# Altium project FMC_Delay_1ns_4Cha.PrjPcb (part 3 of 3)

## Sheet LED_MEM.SchDoc: LEDs, sensors and ID EEPROM
size 297 x 209 mm; CheckedBy: -; CompanyName: CERN; DrawnBy: GK, TW; Organization: CERN; Address1: European Organization for Nuclear Research; Address2: CH-1211 Geneve 23 - Switzerland; Revision: -; SheetNumber: 4; SheetTotal: 9; EDA_Number: EDA-02667-V2-0; Projet: FMC Delay 1ns 4cha; ModifiedBy: -; CreateDate: XX/XX/XXXX; CheckedDate: -; DivGrp: BE-CO; Designer: GK, TW; ModifiedDate: -
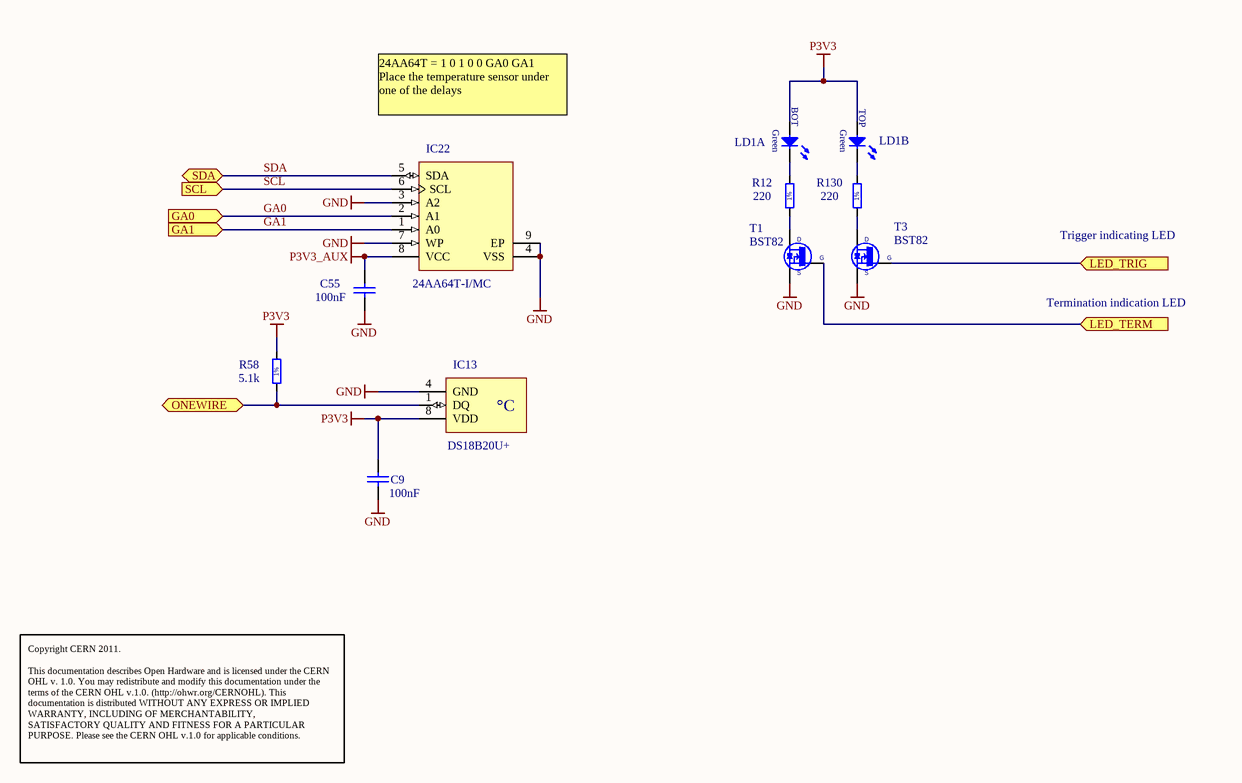
[diagram p8: LED_MEM.SchDoc]

### Parts
C9  100nF  [CAPC1608X87N]
C55  100nF  [CAPC1608X87N]
IC13  DS18B20U+  [SOP65P490X110-8N]
IC22  24AA64T-I/MC  [SON50P300X200X100-9N-S175X155]
LD1  Green/Green  [LED_DIALIGHT_571-0122-100F]  (value not drawn)  (parts A,B of 2)
R12  220  [RESC1608X55N]
R58  5.1k  [RESC1608X55N]
R130  220  [RESC1608X55N]
T1  BST82  [SOT95P240X110-3N]
T3  BST82  [SOT95P240X110-3N]

### Ports
GA0 (in), GA1 (in), LED_TERM (in), LED_TRIG (in), ONEWIRE (bidir), SCL (in), SDA (bidir)

### Nets
GND: C9.2 C55.2 IC13.4(GND) IC22.3(A2) IC22.4(VSS) IC22.7(WP) IC22.9(EP) T1.2(S) T3.2(S)
P3V3: C9.1 IC13.8(VDD) LD1.2(A) LD1.4(A) R58.2
P3V3_AUX: C55.1 IC22.8(VCC)
GA0: IC22.2(A1) ; port GA0
GA1: IC22.1(A0) ; port GA1
LED_TERM: T1.1(G) ; port LED_TERM
SCL: IC22.6(SCL) ; port SCL
SDA: IC22.5(SDA) ; port SDA
NetIC13_1: IC13.1(DQ) R58.1 ; port ONEWIRE
NetLD1_1: LD1.1(C) R12.2
NetLD1_3: LD1.3(C) R130.2
NetR12_1: R12.1 T1.3(D)
NetR130_1: R130.1 T3.3(D)
NetT3_1: T3.1(G) ; port LED_TRIG

### Notes on the sheet
- 24AA64T = 1 0 1 0 0 GA0 GA1
  Place the temperature sensor under one of the delays
- Trigger indicating LED
- Termination indication LED
- Copyright CERN 2011.
  This documentation describes Open Hardware and is licensed under the CERN OHL v. 1.0. You may redistribute and modify this documentation under the terms of the CERN OHL v.1.0. (http://ohwr.org/CERNOHL). This documentation is distributed WITHOUT ANY EXPRESS OR IMPLIED WARRANTY, INCLUDING OF MERCHANTABILITY, SATISFACTORY QUALITY AND FITNESS FOR A PARTICULAR PURPOSE. Please see the CERN OHL v.1.0 for applicable conditions.
- Project/Equipment
- Document
- Designer
- Drawn by
- Check.by
- File
- Last Mod.
- Print Date
- Sheet
- Size
- A4
- of
- Rev
- (in symbol DS18B20U+) °C
- (in symbol LED_DIALIGHT_571-0122-100F, part A) BOT; Green
- (in symbol LED_DIALIGHT_571-0122-100F, part B) TOP; Green
- (in symbol R0603_5K1_1%_0.1W_100PPM) 1%
- (in symbol R0603_220R_1%_0.1W_100PPM) 1%

### Library data of the parts
C9 C55 = CC0603_100NF_50V_10%_X7R: as C75-C77 on sheet INPUT_LOGIC; Part Number: CC0603_100NF_50V_10%_X7R; Component Kind: Standard; Component Type: Standard; Pin Count: 2; Value: 100nF; Status: Preferred; Manufacturer Part Number: CC0603_100NF_50V_10%_X7R; Case: 0603; Mounted: Yes; Socket: No; SMD: Yes; Manufacturer1 Example: PHYCOMP; Manufacturer1 ComponentHeight: 0.87mm; HelpURL: \\cern.ch\dfs\Applications\Altium\Datasheets\CC0603_X7R_PHYCOMP.pdf; Author: CERN DEM JLC; CreateDate: 12/3/2007; LatestRevisionDate: 12/3/2007
IC13 = DS18B20U+: Programmable Resolution 1-Wire Digital Thermometer; Part Description: Programmable Resolution 1-Wire Digital Thermometer (-55°C to +125°C); Manufacturer: DALLAS MAXIM; Table: Sensors; Part Number: DS18B20U+; Component Kind: Standard; Component Type: Standard; Device: DS18B20U+; PackageDescription: SOP, 0.65mm pitch; 8 pin, 3.00mm W X 3.00mm L X 1.10mm H body, IPC Medium Density; Manufacturer Part Number: DS18B20U+; Pin Count: 3; Case: uSOP8; Mounted: Yes; Socket: No; SMD: No; ComponentHeight: 1.1mm; HelpURL: \\cern.ch\dfs\Applications\Altium\Datasheets\DS18B20U+.pdf; Author: CERN DEM JLC; CreateDate: 3/17/2010; LatestRevisionDate: 3/17/2010
IC22 = 24AA64T-I/MC: 1.7-5.5V 64K I2C Serial EEPROM; Part Description: 1.7V-5.5V, 64K  (8K x 8-bit) I2C Serial EEPROM; Manufacturer: MICROCHIP TECHNOLOGY; Table: Logic; Part Number: 24AA64T-I/MC; Component Kind: Standard; Component Type: Standard; Device: 24AA64T-I/MC; PackageDescription: SON (DFN), 0.50mm pitch, 8 pin, 2mm X 3mm X 1.00mm H body (w/thermal tab 1.75 X 1.55mm),  IPC Medium Density; Manufacturer Part Number: 24AA64T-I/MC; Pin Count: 9; Case: DFN8; Mounted: Yes; Socket: No; SMD: Yes; ComponentHeight: 1.0mm; HelpURL: \\cern.ch\dfs\Applications\Altium\Datasheets\24AA64T-I-MC.pdf; Author: CERN DEM JLC; CreateDate: 11/18/2009; LatestRevisionDate: 1/24/2011
LD1 = LED_DIALIGHT_571-0122-100F: LED x2 Green 1C2A-BOT_3C4A-TOP; Part Description: Dual 2mm Green LEDs CBI® Circuit Board Indicator (With positioning pins); Table: LEDs & Displays; Part Number: LED_DIALIGHT_571-0122-100F; Component Kind: Standard; Component Type: Standard; Color: Green/Green; PackageDescription: 2x 2mm Red LED PCB Edge Mounting (With positioning pins) DIALIGHT 571 Serie; Manufacturer: DIALIGHT; Manufacturer Part Number: 571-0122-100F; Pin Count: 4; Mounted: Yes; Socket: No; SMD: No; ComponentHeight: 8.6mm; HelpURL: \\cern.ch\dfs\Applications\Altium\Datasheets\LED_DIALIGHT_571-0122-100F.pdf; Author: CERN DEM JLC; CreateDate: 11/5/2009; LatestRevisionDate: 3/17/2010
R12 R130 = R0603_220R_1%_0.1W_100PPM: Resistor - 1%; Part Description: General Purpose Thick Film Chip Resistor; Manufacturer: GENERIC; Manufacturer1 Part Number: NRC06F2200TRF; Power: 0.1W; TC: ±100ppm/°C; Table: Resistors SMD; Part Number: R0603_220R_1%_0.1W_100PPM; Component Kind: Standard; Component Type: Standard; Pin Count: 2; Value: 220; Status: Preferred; Tolerance: ±1%; Manufacturer Part Number: R0603_220R_1%_0.1W_100PPM; Case: 0603; Mounted: Yes; Socket: No; SMD: Yes; Manufacturer1 Example: NIC COMPONENT; Manufacturer1 ComponentHeight: 0.55mm; HelpURL: \\cern.ch\dfs\Applications\Altium\Datasheets\R0603_NIC_NRC.pdf; Author: CERN DEM JLC; CreateDate: 12/3/2007; LatestRevisionDate: 3/13/2008
R58 = R0603_5K1_1%_0.1W_100PPM: Resistor - 1%; Part Description: General Purpose Thick Film Chip Resistor; Manufacturer: GENERIC; Manufacturer1 Part Number: NRC06F5101TRF; Value: 5k1; Power: 0.1W; TC: ±100ppm/°C; Table: Resistors SMD; Part Number: R0603_5K1_1%_0.1W_100PPM; Component Kind: Standard; Component Type: Standard; Designator: Resistor - 1%; Library Reference: Resistor - 1%; Pin Count: 2; Status: Preferred; Tolerance: ±1%; Manufacturer Part Number: R0603_5K1_1%_0.1W_100PPM; Case: 0603; Mounted: Yes; Socket: No; SMD: Yes; Manufacturer1 Example: NIC COMPONENT; Manufacturer1 ComponentHeight: 0.55mm; HelpURL: \\cern.ch\dfs\Applications\Altium\Datasheets\R0603_NIC_NRC.pdf; Author: CERN DEM JLC; CreateDate: 12/3/2007; LatestRevisionDate: 3/13/2008
T1 T3 = BST82: N-CHANNEL MOSFET WITH DIODE; Part Description: 100V 190mA N-Channel Enhancement Mode Field-Effect Transistor; Manufacturer: NXP SEMICONDUCTORS; Table: Transistors; Part Number: BST82; Component Kind: Standard; Component Type: Standard; Device: BST82; PackageDescription: SOT23 3-Leads, Pitch 0.95mm - Body 1.4x3mm, IPC Medium Density; Manufacturer Part Number: BST82; Pin Count: 3; Case: SOT23-3; Mounted: Yes; Socket: No; SMD: Yes; ComponentHeight: 1.1mm; HelpURL: \\cern.ch\dfs\Applications\Altium\Datasheets\BST82.pdf; Author: CERN DEM JLC; CreateDate: 5/14/2008; LatestRevisionDate: 5/14/2008

## Nets that join several sheets
FF_VBB: U_CHANNEL_DELAY (C4A.1 IC3A.2 IC3A.3 IC3A.9), U_CHANNEL_DELAY (C4B.1 IC3B.2 IC3B.3 IC3B.9)
GND: FMC_Delay_1ns_4Cha (9 pins), clock_generator (25 pins), FMC connector (66 pins), power_supply (12 pins), TDC (50 pins), U_CHANNEL_DELAY (34 pins), U_CHANNEL_DELAY (34 pins), OUTPUT_BUFFER (20 pins), INPUT_LOGIC (12 pins), LED_MEM (9 pins)
P3V3: FMC_Delay_1ns_4Cha (6 pins), clock_generator (L3.1 L17.1), FMC connector (J6.c39 J6.d36 J6.d38 J6.d40), power_supply (D1.3 IC12.5 IC16.2 IC16.8), TDC (8 pins), U_CHANNEL_DELAY (20 pins), U_CHANNEL_DELAY (20 pins), OUTPUT_BUFFER (IC15.5), INPUT_LOGIC (6 pins), LED_MEM (5 pins)
P3V3_AUX: FMC connector (J6.d32), LED_MEM (C55.1 IC22.8)
P5V0: power_supply (6 pins), TDC (6 pins), OUTPUT_BUFFER (10 pins), INPUT_LOGIC (D5.2)
P12V0: FMC connector (J6.c35 J6.c37), power_supply (C41.1 C43.1 IC12.7)
VADJ: FMC connector (J6.g39 J6.h40), power_supply (R44.1)
CLK1_N: clock_generator (IC4.40), U_CHANNEL_DELAY (IC3A.5 R8A.2)
CLK1_N: clock_generator (IC4.53), U_CHANNEL_DELAY (IC3B.5 R8B.2)
CLK1_P: clock_generator (IC4.39), U_CHANNEL_DELAY (IC3A.4 R10A.2)
CLK1_P: clock_generator (IC4.52), U_CHANNEL_DELAY (IC3B.4 R10B.2)
CLK2_N: clock_generator (IC4.43), U_CHANNEL_DELAY (IC3A.7 R14A.2)
CLK2_N: clock_generator (IC4.56), U_CHANNEL_DELAY (IC3B.7 R14B.2)
CLK2_P: clock_generator (IC4.42), U_CHANNEL_DELAY (IC3A.6 R21A.2)
CLK2_P: clock_generator (IC4.55), U_CHANNEL_DELAY (IC3B.6 R21B.2)
CLK125_N: clock_generator (IC4.36), FMC connector (J6.g3)
CLK125_P: clock_generator (IC4.35), FMC connector (J6.g2)
D1_N: TDC (IC18.2), U_CHANNEL_DELAY (IC2B.5 IC3B.16 R2B.2)
D1_P: TDC (IC18.1), U_CHANNEL_DELAY (IC2B.4 IC3B.17 R3B.2)
DELAY_D0: FMC connector (J6.h38), U_CHANNEL_DELAY (IC2A.23 IC7A.23), U_CHANNEL_DELAY (IC2B.23 IC7B.23)
DELAY_D1: FMC connector (J6.h37), U_CHANNEL_DELAY (IC2A.25 IC7A.25), U_CHANNEL_DELAY (IC2B.25 IC7B.25)
DELAY_D2: FMC connector (J6.g37), U_CHANNEL_DELAY (IC2A.26 IC7A.26), U_CHANNEL_DELAY (IC2B.26 IC7B.26)
DELAY_D3: FMC connector (J6.g36), U_CHANNEL_DELAY (IC2A.27 IC7A.27), U_CHANNEL_DELAY (IC2B.27 IC7B.27)
DELAY_D4: FMC connector (J6.h35), U_CHANNEL_DELAY (IC2A.29 IC7A.29), U_CHANNEL_DELAY (IC2B.29 IC7B.29)
DELAY_D5: FMC connector (J6.h34), U_CHANNEL_DELAY (IC2A.30 IC7A.30), U_CHANNEL_DELAY (IC2B.30 IC7B.30)
DELAY_D6: FMC connector (J6.g34), U_CHANNEL_DELAY (IC2A.31 IC7A.31), U_CHANNEL_DELAY (IC2B.31 IC7B.31)
DELAY_D7: FMC connector (J6.g33), U_CHANNEL_DELAY (IC2A.32 IC7A.32), U_CHANNEL_DELAY (IC2B.32 IC7B.32)
DELAY_D8: FMC connector (J6.h32), U_CHANNEL_DELAY (IC2A.1 IC7A.1), U_CHANNEL_DELAY (IC2B.1 IC7B.1)
DELAY_D9: FMC connector (J6.h31), U_CHANNEL_DELAY (IC2A.2 IC7A.2), U_CHANNEL_DELAY (IC2B.2 IC7B.2)
DELAY_LEN1: FMC connector (J6.h28), U_CHANNEL_DELAY (IC2A.10)
DELAY_LEN2: FMC connector (J6.h29), U_CHANNEL_DELAY (IC7A.10)
DELAY_LEN3: FMC connector (J6.g31), U_CHANNEL_DELAY (IC2B.10)
DELAY_LEN4: FMC connector (J6.g30), U_CHANNEL_DELAY (IC7B.10)
DIN1: FMC connector (J6.h26), U_CHANNEL_DELAY (R1A.1)
DIN2: FMC connector (J6.h25), U_CHANNEL_DELAY (R52A.1)
DIN3: FMC connector (J6.g28), U_CHANNEL_DELAY (R1B.1)
DIN4: FMC connector (J6.g27), U_CHANNEL_DELAY (R52B.1)
EXT_CSn: FMC_Delay_1ns_4Cha (IC19.7), FMC connector (J6.g21)
FPGA_TDC_START_N: clock_generator (C24.1), FMC connector (J6.h5)
FPGA_TDC_START_P: clock_generator (C12.1), FMC connector (J6.h4)
GA0: FMC connector (J6.c34), LED_MEM (IC22.2)
GA1: FMC connector (J6.d35), LED_MEM (IC22.1)
LED_TERM: FMC_Delay_1ns_4Cha (IC19.27), LED_MEM (T1.1)
NetF1_2: FMC_Delay_1ns_4Cha (J1.1), OUTPUT_BUFFER (F1.2)
NetF2_2: FMC_Delay_1ns_4Cha (J2.1), OUTPUT_BUFFER (F2.2)
NetF3_2: FMC_Delay_1ns_4Cha (J3.1), OUTPUT_BUFFER (F3.2)
NetF4_2: FMC_Delay_1ns_4Cha (J4.1), OUTPUT_BUFFER (F4.2)
NetF5_1: FMC_Delay_1ns_4Cha (J5.1), INPUT_LOGIC (F5.1)
NetIC1A_6: U_CHANNEL_DELAY (IC1A.6), OUTPUT_BUFFER (IC11.17 IC11.22)
NetIC1A_7: U_CHANNEL_DELAY (IC1A.7), OUTPUT_BUFFER (IC11.18 IC11.23)
NetIC1B_6: U_CHANNEL_DELAY (IC1B.6), OUTPUT_BUFFER (IC11.14 IC11.19)
NetIC1B_7: U_CHANNEL_DELAY (IC1B.7), OUTPUT_BUFFER (IC11.15 IC11.20)
NetIC4_17: clock_generator (IC4.17), FMC connector (J6.d27)
NetIC4_46: clock_generator (IC4.46), TDC (IC8.56)
NetIC8_4: FMC connector (J6.g24), TDC (IC8.4)
NetIC8_5: FMC connector (J6.g25), TDC (IC8.5 IC8.6 IC8.8 IC8.9)
NetIC13_1: FMC connector (J6.h20), LED_MEM (IC13.1 R58.1)
NetIC14_5: clock_generator (IC14.5), FMC connector (J6.d24)
NetIC17_1: FMC connector (J6.g7), INPUT_LOGIC (IC17.1)
NetJ6_g18: FMC connector (J6.g18), TDC (RN4.9)
NetJ6_g19: FMC connector (J6.g19), TDC (RN4.11)
OUTPUT_ENABLE: FMC_Delay_1ns_4Cha (IC19.25), OUTPUT_BUFFER (IC15.1 R111.2)
PLL_LD: FMC_Delay_1ns_4Cha (IC19.2), clock_generator (IC4.3)
PLL_REFMON: FMC_Delay_1ns_4Cha (IC19.1), clock_generator (IC4.2)
PLL_STATUS: FMC_Delay_1ns_4Cha (IC19.3), clock_generator (IC4.6)
RESETn: FMC_Delay_1ns_4Cha (IC19.14), clock_generator (IC4.23), power_supply (IC16.5), TDC (IC8.67), OUTPUT_BUFFER (IC15.2 R113.2)
SCL: FMC connector (J6.c30), LED_MEM (IC22.6)
SCLK: FMC_Delay_1ns_4Cha (IC19.8), clock_generator (IC4.16 IC14.6), FMC connector (J6.d26)
SDA: FMC connector (J6.c31), LED_MEM (IC22.5)
SDI: FMC_Delay_1ns_4Cha (IC19.9), clock_generator (IC4.22 IC14.7), FMC connector (J6.c26)
SDO: FMC_Delay_1ns_4Cha (R68.2), clock_generator (R114.2), FMC connector (J6.c27)
TDC_ADR0: FMC connector (J6.c22), TDC (IC8.74)
TDC_ADR1: FMC connector (J6.c23), TDC (IC8.73)
TDC_ADR2: FMC connector (J6.h22), TDC (IC8.72)
TDC_ADR3: FMC connector (J6.h23), TDC (IC8.71)
TDC_CAL_STOP1: TDC (IC8.76), OUTPUT_BUFFER (IC11.7)
TDC_CAL_STOP2: TDC (IC8.70), OUTPUT_BUFFER (IC11.9)
TDC_CAL_STOP3: TDC (IC8.7), OUTPUT_BUFFER (IC11.10)
TDC_CAL_STOP4: TDC (IC8.11), OUTPUT_BUFFER (IC11.12)
TDC_CSN: FMC connector (J6.g22), TDC (IC8.14)
TDC_D0: FMC connector (J6.d9), TDC (RN1.9)
TDC_D1: FMC connector (J6.h11), TDC (RN1.10)
TDC_D2: FMC connector (J6.d8), TDC (RN1.11)
TDC_D3: FMC connector (J6.h10), TDC (RN1.12)
TDC_D4: FMC connector (J6.g10), TDC (RN1.13)
TDC_D5: FMC connector (J6.g9), TDC (RN1.14)
TDC_D6: FMC connector (J6.h8), TDC (RN1.15)
TDC_D7: FMC connector (J6.h7), TDC (RN1.16)
TDC_D8: FMC connector (J6.c10), TDC (RN2.16)
TDC_D9: FMC connector (J6.c11), TDC (RN2.15)
TDC_D10: FMC connector (J6.g12), TDC (RN2.14)
TDC_D11: FMC connector (J6.g13), TDC (RN2.13)
TDC_D12: FMC connector (J6.d11), TDC (RN2.12)
TDC_D13: FMC connector (J6.d12), TDC (RN2.11)
TDC_D14: FMC connector (J6.h13), TDC (RN2.10)
TDC_D15: FMC connector (J6.h14), TDC (RN2.9)
TDC_D16: FMC connector (J6.d14), TDC (RN3.16)
TDC_D17: FMC connector (J6.d15), TDC (RN3.15)
TDC_D18: FMC connector (J6.c14), TDC (RN3.14)
TDC_D19: FMC connector (J6.c15), TDC (RN3.13)
TDC_D20: FMC connector (J6.g15), TDC (RN3.12)
TDC_D21: FMC connector (J6.g16), TDC (RN3.11)
TDC_D22: FMC connector (J6.h16), TDC (RN3.10)
TDC_D23: FMC connector (J6.h17), TDC (RN3.9)
TDC_D24: FMC connector (J6.d17), TDC (RN4.15)
TDC_D25: FMC connector (J6.d18), TDC (RN4.14)
TDC_D26: FMC connector (J6.c18), TDC (RN4.13)
TDC_D27: FMC connector (J6.c19), TDC (RN4.12)
TDC_OEN: FMC connector (J6.d23), TDC (IC8.63)
TDC_RDN: FMC connector (J6.d21), TDC (IC8.15)
TDC_START_N: clock_generator (IC4.25), TDC (IC8.92 R47.2)
TDC_START_P: clock_generator (IC4.26), TDC (IC8.93 R46.2)
TDC_STOP_N: TDC (IC8.96 R50.2), INPUT_LOGIC (IC5.3)
TDC_STOP_P: TDC (IC8.97 R49.2), INPUT_LOGIC (IC5.2)
TDC_WRN: FMC connector (J6.d20), TDC (IC8.13)
TERM_ENABLE: FMC_Delay_1ns_4Cha (IC19.4), INPUT_LOGIC (T2.1)
TRIG_OUT_LVTTL: FMC connector (J6.g6), INPUT_LOGIC (R109.1)
TRIG_SEL: FMC_Delay_1ns_4Cha (IC19.28), INPUT_LOGIC (IC17.9 R107.1)